# Altium schematic sheet InterfacesB_CONNECTORS.SchDoc
size A; DocumentNumber: 11; SheetNumber: 11
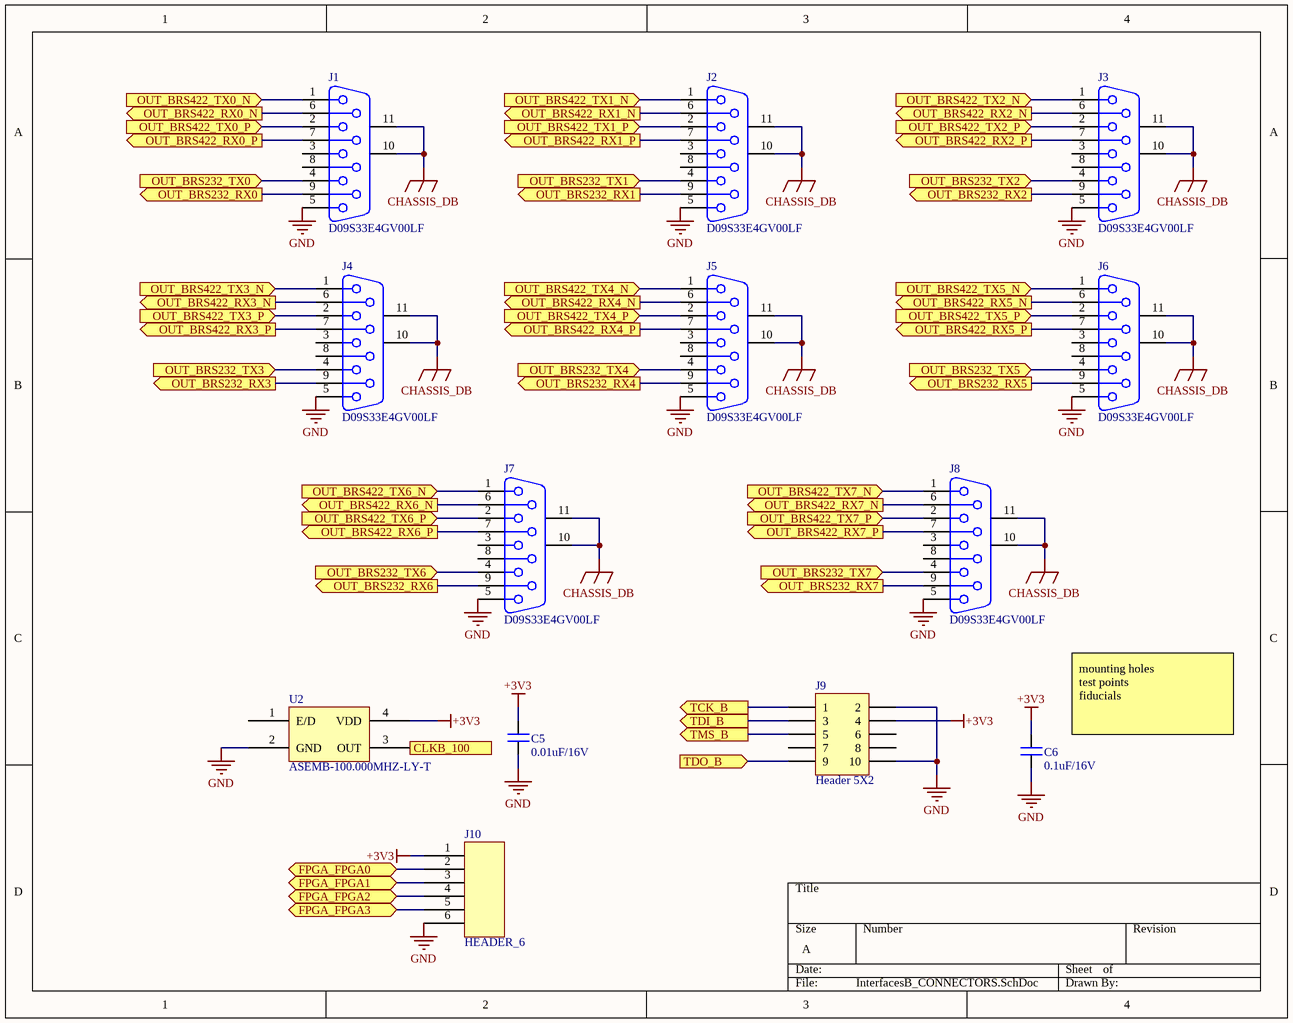
[diagram p0: InterfacesB_CONNECTORS.SchDoc]

## Parts
C5  value 0.01uF/16V  [CAP_0805]  (hidden comment: CAP_0805)
C6  value 0.1uF/16V  [CAP_0805]  (hidden comment: CAP_0805)
J1  D09S33E4GV00LF  [D09S33E4GV00LF]
J2  D09S33E4GV00LF  [D09S33E4GV00LF]
J3  D09S33E4GV00LF  [D09S33E4GV00LF]
J4  D09S33E4GV00LF  [D09S33E4GV00LF]
J5  D09S33E4GV00LF  [D09S33E4GV00LF]
J6  D09S33E4GV00LF  [D09S33E4GV00LF]
J7  D09S33E4GV00LF  [D09S33E4GV00LF]
J8  D09S33E4GV00LF  [D09S33E4GV00LF]
J9  Header 5X2  [HEADER 5x2]
J10  HEADER_6  [HEADER_6]
U2  ASEMB-100.000MHZ-LY-T  [ASEMB-100.000MHZ-LY-T]

## Ports
CLKB_100 (out), FPGA_FPGA0 (bidir), FPGA_FPGA1 (bidir), FPGA_FPGA2 (bidir), FPGA_FPGA3 (bidir), OUT_BRS232_RX0 (out), OUT_BRS232_RX1 (out), OUT_BRS232_RX2 (out), OUT_BRS232_RX3 (out), OUT_BRS232_RX4 (out), OUT_BRS232_RX5 (out), OUT_BRS232_RX6 (out), OUT_BRS232_RX7 (out), OUT_BRS232_TX0 (in), OUT_BRS232_TX1 (in), OUT_BRS232_TX2 (in), OUT_BRS232_TX3 (in), OUT_BRS232_TX4 (in), OUT_BRS232_TX5 (in), OUT_BRS232_TX6 (in), OUT_BRS232_TX7 (in), OUT_BRS422_RX0_N (out), OUT_BRS422_RX0_P (out), OUT_BRS422_RX1_N (out), OUT_BRS422_RX1_P (out), OUT_BRS422_RX2_N (out), OUT_BRS422_RX2_P (out), OUT_BRS422_RX3_N (out), OUT_BRS422_RX3_P (out), OUT_BRS422_RX4_N (out), OUT_BRS422_RX4_P (out), OUT_BRS422_RX5_N (out), OUT_BRS422_RX5_P (out), OUT_BRS422_RX6_N (out), OUT_BRS422_RX6_P (out), OUT_BRS422_RX7_N (out), OUT_BRS422_RX7_P (out), OUT_BRS422_TX0_N (in), OUT_BRS422_TX0_P (in), OUT_BRS422_TX1_N (in), OUT_BRS422_TX1_P (in), OUT_BRS422_TX2_N (in), OUT_BRS422_TX2_P (in), OUT_BRS422_TX3_N (in), OUT_BRS422_TX3_P (in), OUT_BRS422_TX4_N (in), OUT_BRS422_TX4_P (in), OUT_BRS422_TX5_N (in), OUT_BRS422_TX5_P (in), OUT_BRS422_TX6_N (in), OUT_BRS422_TX6_P (in), OUT_BRS422_TX7_N (in), OUT_BRS422_TX7_P (in), TCK_B (out), TDI_B (out), TDO_B (in), TMS_B (out)

## Nets
+3V3: C5.2 C6.2 J9.4 J10.1 U2.4(VDD)
CHASSIS_DB: J1.10(MH1) J1.11(MH2) J2.10(MH1) J2.11(MH2) J3.10(MH1) J3.11(MH2) J4.10(MH1) J4.11(MH2) J5.10(MH1) J5.11(MH2) J6.10(MH1) J6.11(MH2) J7.10(MH1) J7.11(MH2) J8.10(MH1) J8.11(MH2)
GND: C5.1 C6.1 J1.5 J2.5 J3.5 J4.5 J5.5 J6.5 J7.5 J8.5 J9.2 J9.10 J10.6 U2.2(GND)
CLKB_100: U2.3(OUT) ; port CLKB_100
FPGA_FPGA0: J10.2 ; port FPGA_FPGA0
FPGA_FPGA1: J10.3 ; port FPGA_FPGA1
FPGA_FPGA2: J10.4 ; port FPGA_FPGA2
FPGA_FPGA3: J10.5 ; port FPGA_FPGA3
OUT_BRS232_RX0: J1.9 ; port OUT_BRS232_RX0
OUT_BRS232_RX1: J2.9 ; port OUT_BRS232_RX1
OUT_BRS232_RX2: J3.9 ; port OUT_BRS232_RX2
OUT_BRS232_RX3: J4.9 ; port OUT_BRS232_RX3
OUT_BRS232_RX4: J5.9 ; port OUT_BRS232_RX4
OUT_BRS232_RX5: J6.9 ; port OUT_BRS232_RX5
OUT_BRS232_RX6: J7.9 ; port OUT_BRS232_RX6
OUT_BRS232_RX7: J8.9 ; port OUT_BRS232_RX7
OUT_BRS232_TX0: J1.4 ; port OUT_BRS232_TX0
OUT_BRS232_TX1: J2.4 ; port OUT_BRS232_TX1
OUT_BRS232_TX2: J3.4 ; port OUT_BRS232_TX2
OUT_BRS232_TX3: J4.4 ; port OUT_BRS232_TX3
OUT_BRS232_TX4: J5.4 ; port OUT_BRS232_TX4
OUT_BRS232_TX5: J6.4 ; port OUT_BRS232_TX5
OUT_BRS232_TX6: J7.4 ; port OUT_BRS232_TX6
OUT_BRS232_TX7: J8.4 ; port OUT_BRS232_TX7
OUT_BRS422_RX0_N: J1.6 ; port OUT_BRS422_RX0_N
OUT_BRS422_RX0_P: J1.7 ; port OUT_BRS422_RX0_P
OUT_BRS422_RX1_N: J2.6 ; port OUT_BRS422_RX1_N
OUT_BRS422_RX1_P: J2.7 ; port OUT_BRS422_RX1_P
OUT_BRS422_RX2_N: J3.6 ; port OUT_BRS422_RX2_N
OUT_BRS422_RX2_P: J3.7 ; port OUT_BRS422_RX2_P
OUT_BRS422_RX3_N: J4.6 ; port OUT_BRS422_RX3_N
OUT_BRS422_RX3_P: J4.7 ; port OUT_BRS422_RX3_P
OUT_BRS422_RX4_N: J5.6 ; port OUT_BRS422_RX4_N
OUT_BRS422_RX4_P: J5.7 ; port OUT_BRS422_RX4_P
OUT_BRS422_RX5_N: J6.6 ; port OUT_BRS422_RX5_N
OUT_BRS422_RX5_P: J6.7 ; port OUT_BRS422_RX5_P
OUT_BRS422_RX6_N: J7.6 ; port OUT_BRS422_RX6_N
OUT_BRS422_RX6_P: J7.7 ; port OUT_BRS422_RX6_P
OUT_BRS422_RX7_N: J8.6 ; port OUT_BRS422_RX7_N
OUT_BRS422_RX7_P: J8.7 ; port OUT_BRS422_RX7_P
OUT_BRS422_TX0_N: J1.1 ; port OUT_BRS422_TX0_N
OUT_BRS422_TX0_P: J1.2 ; port OUT_BRS422_TX0_P
OUT_BRS422_TX1_N: J2.1 ; port OUT_BRS422_TX1_N
OUT_BRS422_TX1_P: J2.2 ; port OUT_BRS422_TX1_P
OUT_BRS422_TX2_N: J3.1 ; port OUT_BRS422_TX2_N
OUT_BRS422_TX2_P: J3.2 ; port OUT_BRS422_TX2_P
OUT_BRS422_TX3_N: J4.1 ; port OUT_BRS422_TX3_N
OUT_BRS422_TX3_P: J4.2 ; port OUT_BRS422_TX3_P
OUT_BRS422_TX4_N: J5.1 ; port OUT_BRS422_TX4_N
OUT_BRS422_TX4_P: J5.2 ; port OUT_BRS422_TX4_P
OUT_BRS422_TX5_N: J6.1 ; port OUT_BRS422_TX5_N
OUT_BRS422_TX5_P: J6.2 ; port OUT_BRS422_TX5_P
OUT_BRS422_TX6_N: J7.1 ; port OUT_BRS422_TX6_N
OUT_BRS422_TX6_P: J7.2 ; port OUT_BRS422_TX6_P
OUT_BRS422_TX7_N: J8.1 ; port OUT_BRS422_TX7_N
OUT_BRS422_TX7_P: J8.2 ; port OUT_BRS422_TX7_P
TCK_B: J9.1 ; port TCK_B
TDI_B: J9.3 ; port TDI_B
TDO_B: J9.9 ; port TDO_B
TMS_B: J9.5 ; port TMS_B

Not connected (* = marked no-connect by the designer): J1 3 8; J2 3 8; J3 3 8; J4 3 8; J5 3 8; J6 3 8; J7 3 8; J8 3 8; J9 6 7 8; U2 1(E/D)

## Notes on the sheet
- (near C6) mounting holes
  test points
  fiducials

## Library data of the parts
J9 = Header 5X2: Header, 5-Pin, Dual row; LatestRevisionDate: 17-Jul-2002; LatestRevisionNote: Re-released for DXP Platform.; Publisher: Altium Limited
J1-J8 = D09S33E4GV00LF: Supplier 1: Digi-Key; Supplier Part Number 1: 609-5184-ND
U2 = ASEMB-100.000MHZ-LY-T: Supplier 1: Digi-Key; Supplier Part Number 1: 535-11083-1-ND